# EAGLE schematic single1 (EAGLE 6.6.0)
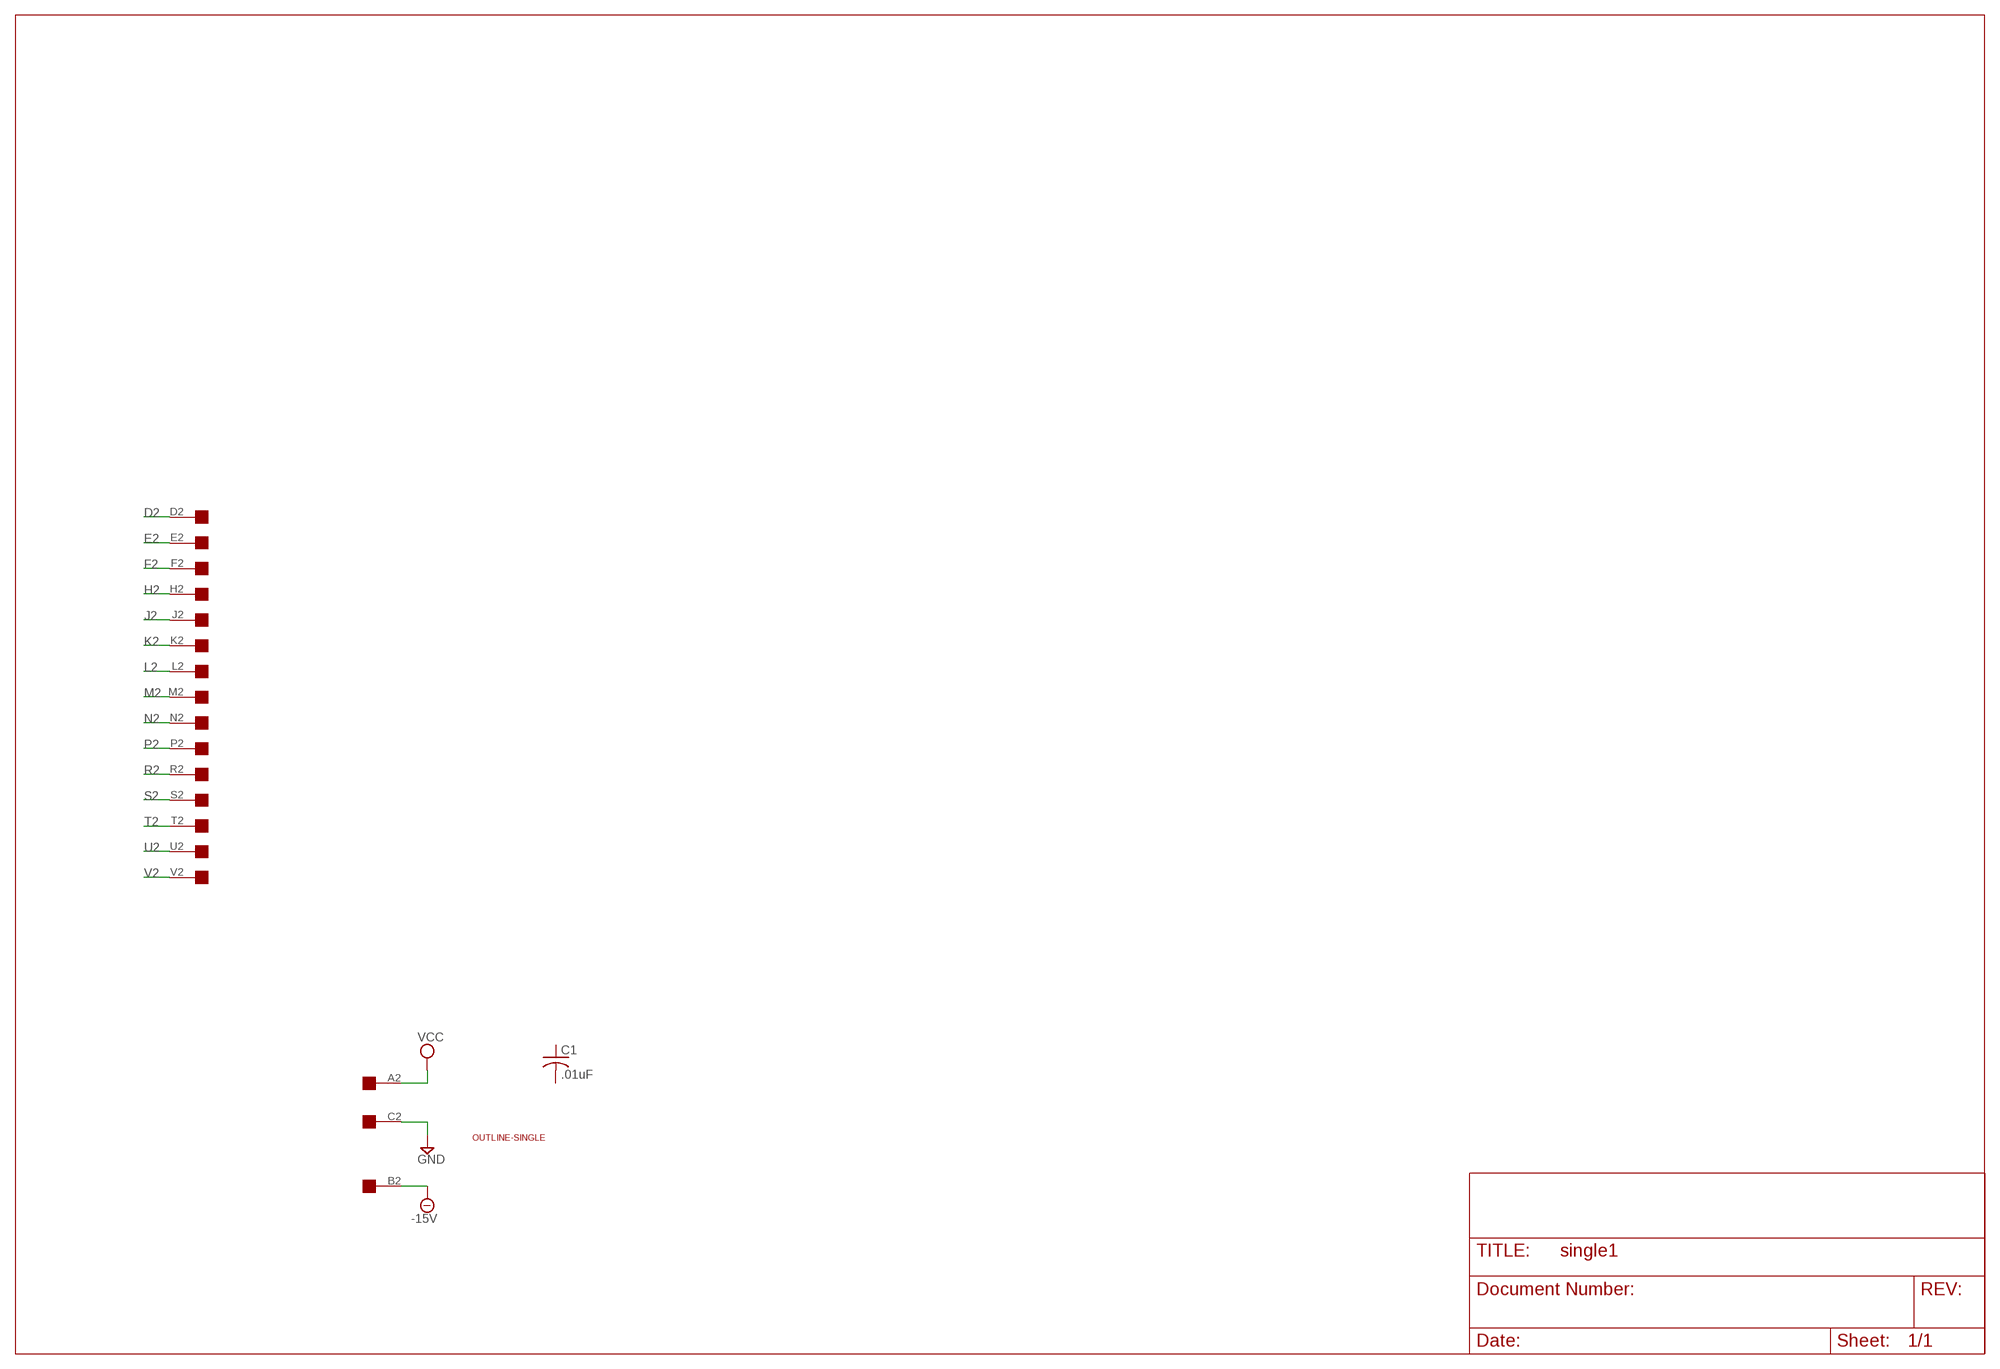
[diagram p0: schematic, sheet 1]

## Parts
C1  .01uF  C-US  [C063-025X075]
U$1  OUTLINE-SINGLE  [SINGLE]
U$2  EDGE-1  [EDGE-CON1]

## Nets
-15V: U$2.B2
D2: U$2.D2
E2: U$2.E2
F2: U$2.F2
GND: U$2.C2
H2: U$2.H2
J2: U$2.J2
K2: U$2.K2
L2: U$2.L2
M2: U$2.M2
N2: U$2.N2
P2: U$2.P2
R2: U$2.R2
S2: U$2.S2
T2: U$2.T2
U2: U$2.U2
V2: U$2.V2
VCC: U$2.A2
Unconnected: C1.1 C1.2

## Library data of the parts
C1 = dec-con:C-US: Capacitors with funky DEC lead spacing.
U$1 = dec-con:OUTLINE-*: Board outlines for DEC boards.
U$2 = dec-con:EDGE-1: Single-Sided DEC Edge Connector -- (side 2)